# EAGLE design BMI160 SCHEMATIC (EAGLE 9.6.2)
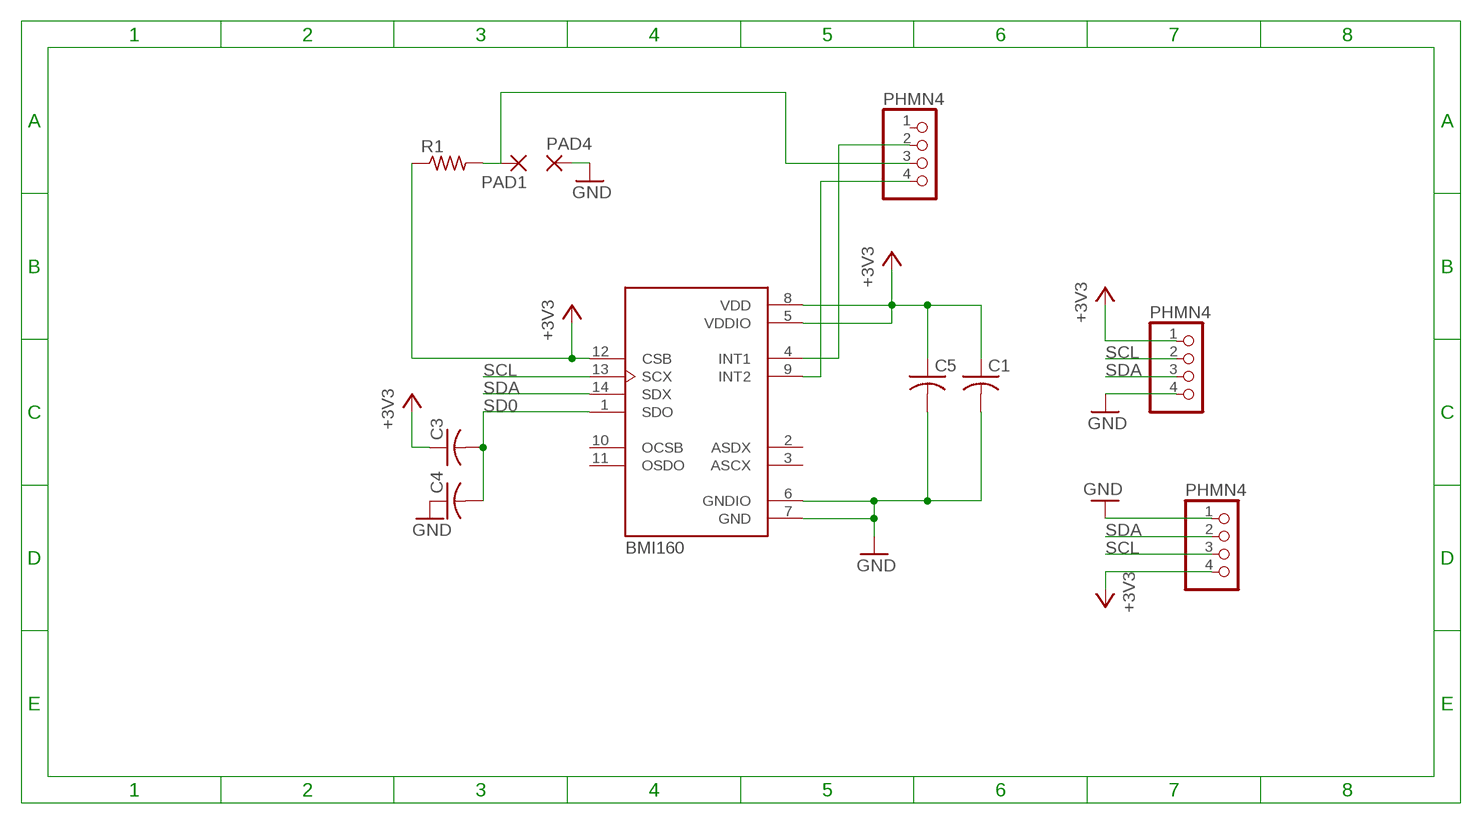
[diagram p0: schematic, sheet 1]

## Parts
C1  C-USC0805  [C0805]
C3  C-USC0805  [C0805]
C4  C-USC0805  [C0805]
C5  C-USC0805  [C0805]
PAD1  WIREPADSMD1,27-254  [SMD1,27-2,54]
PAD4  WIREPADSMD1,27-254  [SMD1,27-2,54]
R1  CRCW08050000Z0EA  [RES_0805]
U1  BMI160  [PQFN50P300X250X88-14N]
U$1  PHMN4  [1X04]
U$2  PHMN4  [1X04]
U$4  PHMN4  [1X04]

## Nets
+3V3: C1.1 C3.1 C5.1 R1.1 U1.5(VDDIO) U1.8(VDD) U1.12(CSB) U$1.1 U$2.4
GND: C1.2 C4.1 C5.2 PAD4.1(P) U1.6(GNDIO) U1.7(GND) U$1.4 U$2.1
N$1: PAD1.1(P) R1.2 U$4.3
N$2: U1.9(INT2) U$4.4
N$5: U1.4(INT1) U$4.2
SCL: U1.13(SCX) U$1.2 U$2.3
SD0: C3.2 C4.2 U1.1(SDO)
SDA: U1.14(SDX) U$1.3 U$2.2
Unconnected: U1.2(ASDX) U1.3(ASCX) U1.10(OCSB) U1.11(OSDO) U$4.1

## Library data of the parts
C1 C3-C5 = rcl:C-US: CAPACITOR, American symbol; SPICEPREFIX: C
PAD1 PAD4 = wirepad:WIREPAD: Wire PAD connect wire on PCB
R1 = Resistor_Capacitor:CRCW08050000Z0EA: RES SMD 0 OHM JUMPER 1/8W 0805 Manufacturer's datasheet <http://www.vishay.com/docs/20035/dcrcwe3.pdf>; CREATED_BY: PCBLayout.com; DIGIKEY_PART_NUMBER: 541-0.0ATR-ND; MANUFACTURER: Vishay Dale; MPN: CRCW08050000Z0EA; PACKAGE: SMD 0805
U1 = BMI160:BMI160: BMI160 2.5 x 3 mm Tiaxial Accelerometer / Gyroscope Inertial Measurement Unit Check prices <https://pricing.snapeda.com/parts/BMI160/Bosch/view-part?ref=eda>; AVAILABILITY: Warning; DESCRIPTION: Accelerometer, Gyroscope, 6 Axis Sensor I²C, SPI Output; MF: Bosch; MP: BMI160; PACKAGE: LGA-14 Bosch; PRICE: None; PURCHASE-URL: https://pricing.snapeda.com/search/part/BMI160/?ref=eda
U$1 U$2 U$4 = USER:PHMN4

## Net classes
0 default: clearance 0.205 mm

## Board
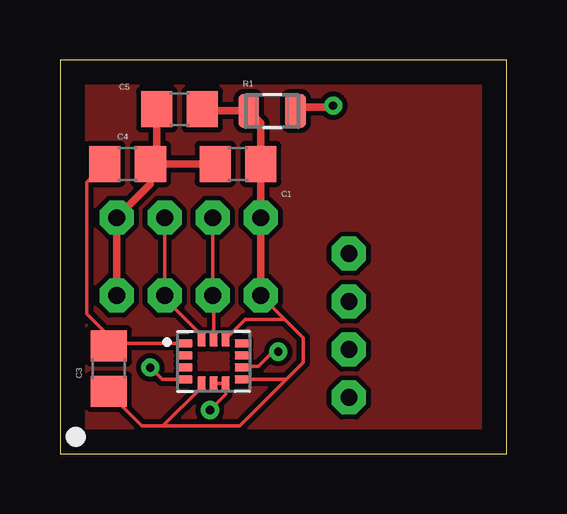
[diagram p1: board, top side]
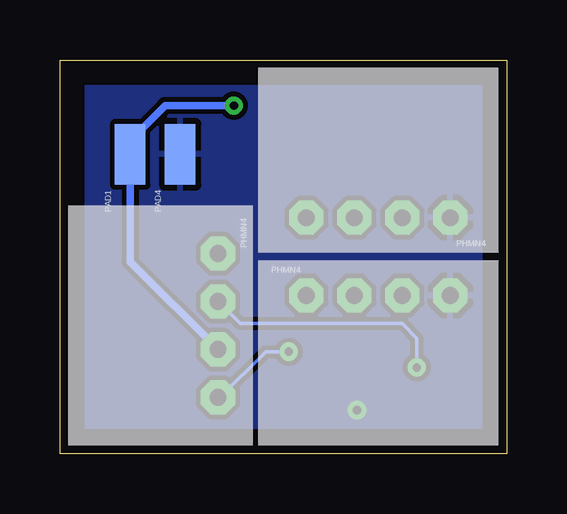
[diagram p2: board, bottom side, seen from below]

Size 18.62 x 16.43 mm. Coordinates in mm from the lower left corner, seen from the top.
Outline: 0,0 18.62,0 18.62,16.43 0,16.43 0,0
Copper layers (1*16): Top 0.035mm / dielectric 1.5mm / Bottom 0.035mm
Design rules "default *": minimum track width 6mil, minimum drill 0.35mm, track to track 0.2mm, track to pad 0.38mm, pad to pad 6mil, via to via 6mil, smd to smd 6mil, copper to edge 40mil, drill to drill 6mil, minimum pad ring 10mil, minimum via ring 8mil, stop-mask expansion 4mil, vias tented up to drill 0mil, thermal gap 10mil

### Footprints (pad centres in the part's own frame; a part is rotated, then mirrored left to right if it is on the bottom)
C0805 = smd 1.3 x 1.5: 1 -0.95,0; 2 0.95,0
SMD1,27-2,54 = smd 1.27 x 2.54: 1 0,0
RES_0805 = smd 0.87 x 1.42: 1 -0.975,0; 2 0.975,0
PQFN50P300X250X88-14N = smd 0.59 x 0.35: 1 -1.165,0.75; 2 -1.165,0.25; 3 -1.165,-0.25; 4 -1.165,-0.75; 8 1.165,-0.75; 9 1.165,-0.25; 10 1.165,0.25; 11 1.165,0.75 | smd 0.35 x 0.59: 5 -0.5,-0.915; 6 0,-0.915; 7 0.5,-0.915; 12 0.5,0.915; 13 0,0.915; 14 -0.5,0.915
1X04 = drill 0.7 pad 1.422 octagon: 1 -3.08,3.71; 2 -1.08,3.71; 3 0.92,3.71; 4 2.92,3.71

### Placement (x,y rotation side)
C1  7.42,12.09 180 top
C3  2.03,3.56 90 top
C4  2.82,12.09 180 top
C5  4.98,14.38 180 top
PAD1  15.7,12.5 0 bottom
PAD4  13.61,12.5 0 bottom
R1  8.84,14.3 0 top
U1  6.4,3.86 0 top
U$1  5.28,2.9 0 bottom
U$2  5.44,13.56 180 bottom
U$4  15.75,5.28 270 bottom

### Tracks (layer width: path | path; a pad name or v marks a point on that pad's centre or on a via)
+3V3
  Top 0.152: U$2.4 8.36,9.8 | U1.5 5.9,2.78 4.29,1.17 | C3.1 2.03,2.54 3.4,1.17 4.29,1.17 | 9.44,3.11 7.49,1.17 4.29,1.17 | 9.37,5.6 U$1.1 | 9.37,5.6 10.14,4.83 10.14,3.81 9.44,3.11 | 9.44,3.11 U1.8 | U1.12 6.99,4.87 6.99,4.88 7.72,5.6 9.37,5.6
  Top 0.305: U$2.4 8.37,9.86 C1.1 8.37,13.8 R1.1 7.84,14.33 5.98,14.33 C5.1 | U$1.1 8.36,9.8
GND  (via drill 0.35)
  Top 0.152: U1.6 U1.7 6.9,2.48 v6.25,1.83 | 4.03,14.13 C5.2 | C4.1 3.96,12.09
  Top 0.305: U$1.4 U$2.1 3.77,11.26 C4.1 C1.2 | C5.2 4.03,12.16 3.96,12.09
  Bottom 0.152: U$1.4
  pour Bottom: 0,0.05 0,16.51 18.59,16.51 18.64,0.05
N$1  (via drill 0.35)
  Top 0.305: v11.38,14.53 11.31,14.46 9.97,14.46 R1.2
  Bottom 0.305: U$4.3 15.7,8.02 PAD1.1 15.7,13.07 14.24,14.53 v11.38,14.53
N$2  (via drill 0.35)
  Top 0.152: U1.9 7.61,3.65 8.26,3.65 8.89,4.29 9.22,4.29 9.2,4.27 v9.09,4.27
  Bottom 0.152: U$4.4 11.97,2.36 10.06,4.27 v9.09,4.27
N$5  (via drill 0.35)
  Top 0.152: U1.4 4.25,3.11 v3.76,3.61
  Bottom 0.152: v3.76,3.61 3.76,4.83 4.37,5.44 11.12,5.44 U$4.2
SCL
  Top 0.152: U1.13 6.4,6.57 U$1.2 U$2.3
SD0
  Top 0.152: U1.1 2.13,4.61 C3.2 2.03,4.92 1.11,5.84 1.11,11.33 C4.2
SDA
  Top 0.152: U1.14 5.9,4.94 4.36,6.48 U$1.3 U$2.2
TOPO
  pour Top: 0,0.05 0,16.51 18.59,16.42 18.59,0.05